# EAGLE design CS42436 Eval (EAGLE 6.3)
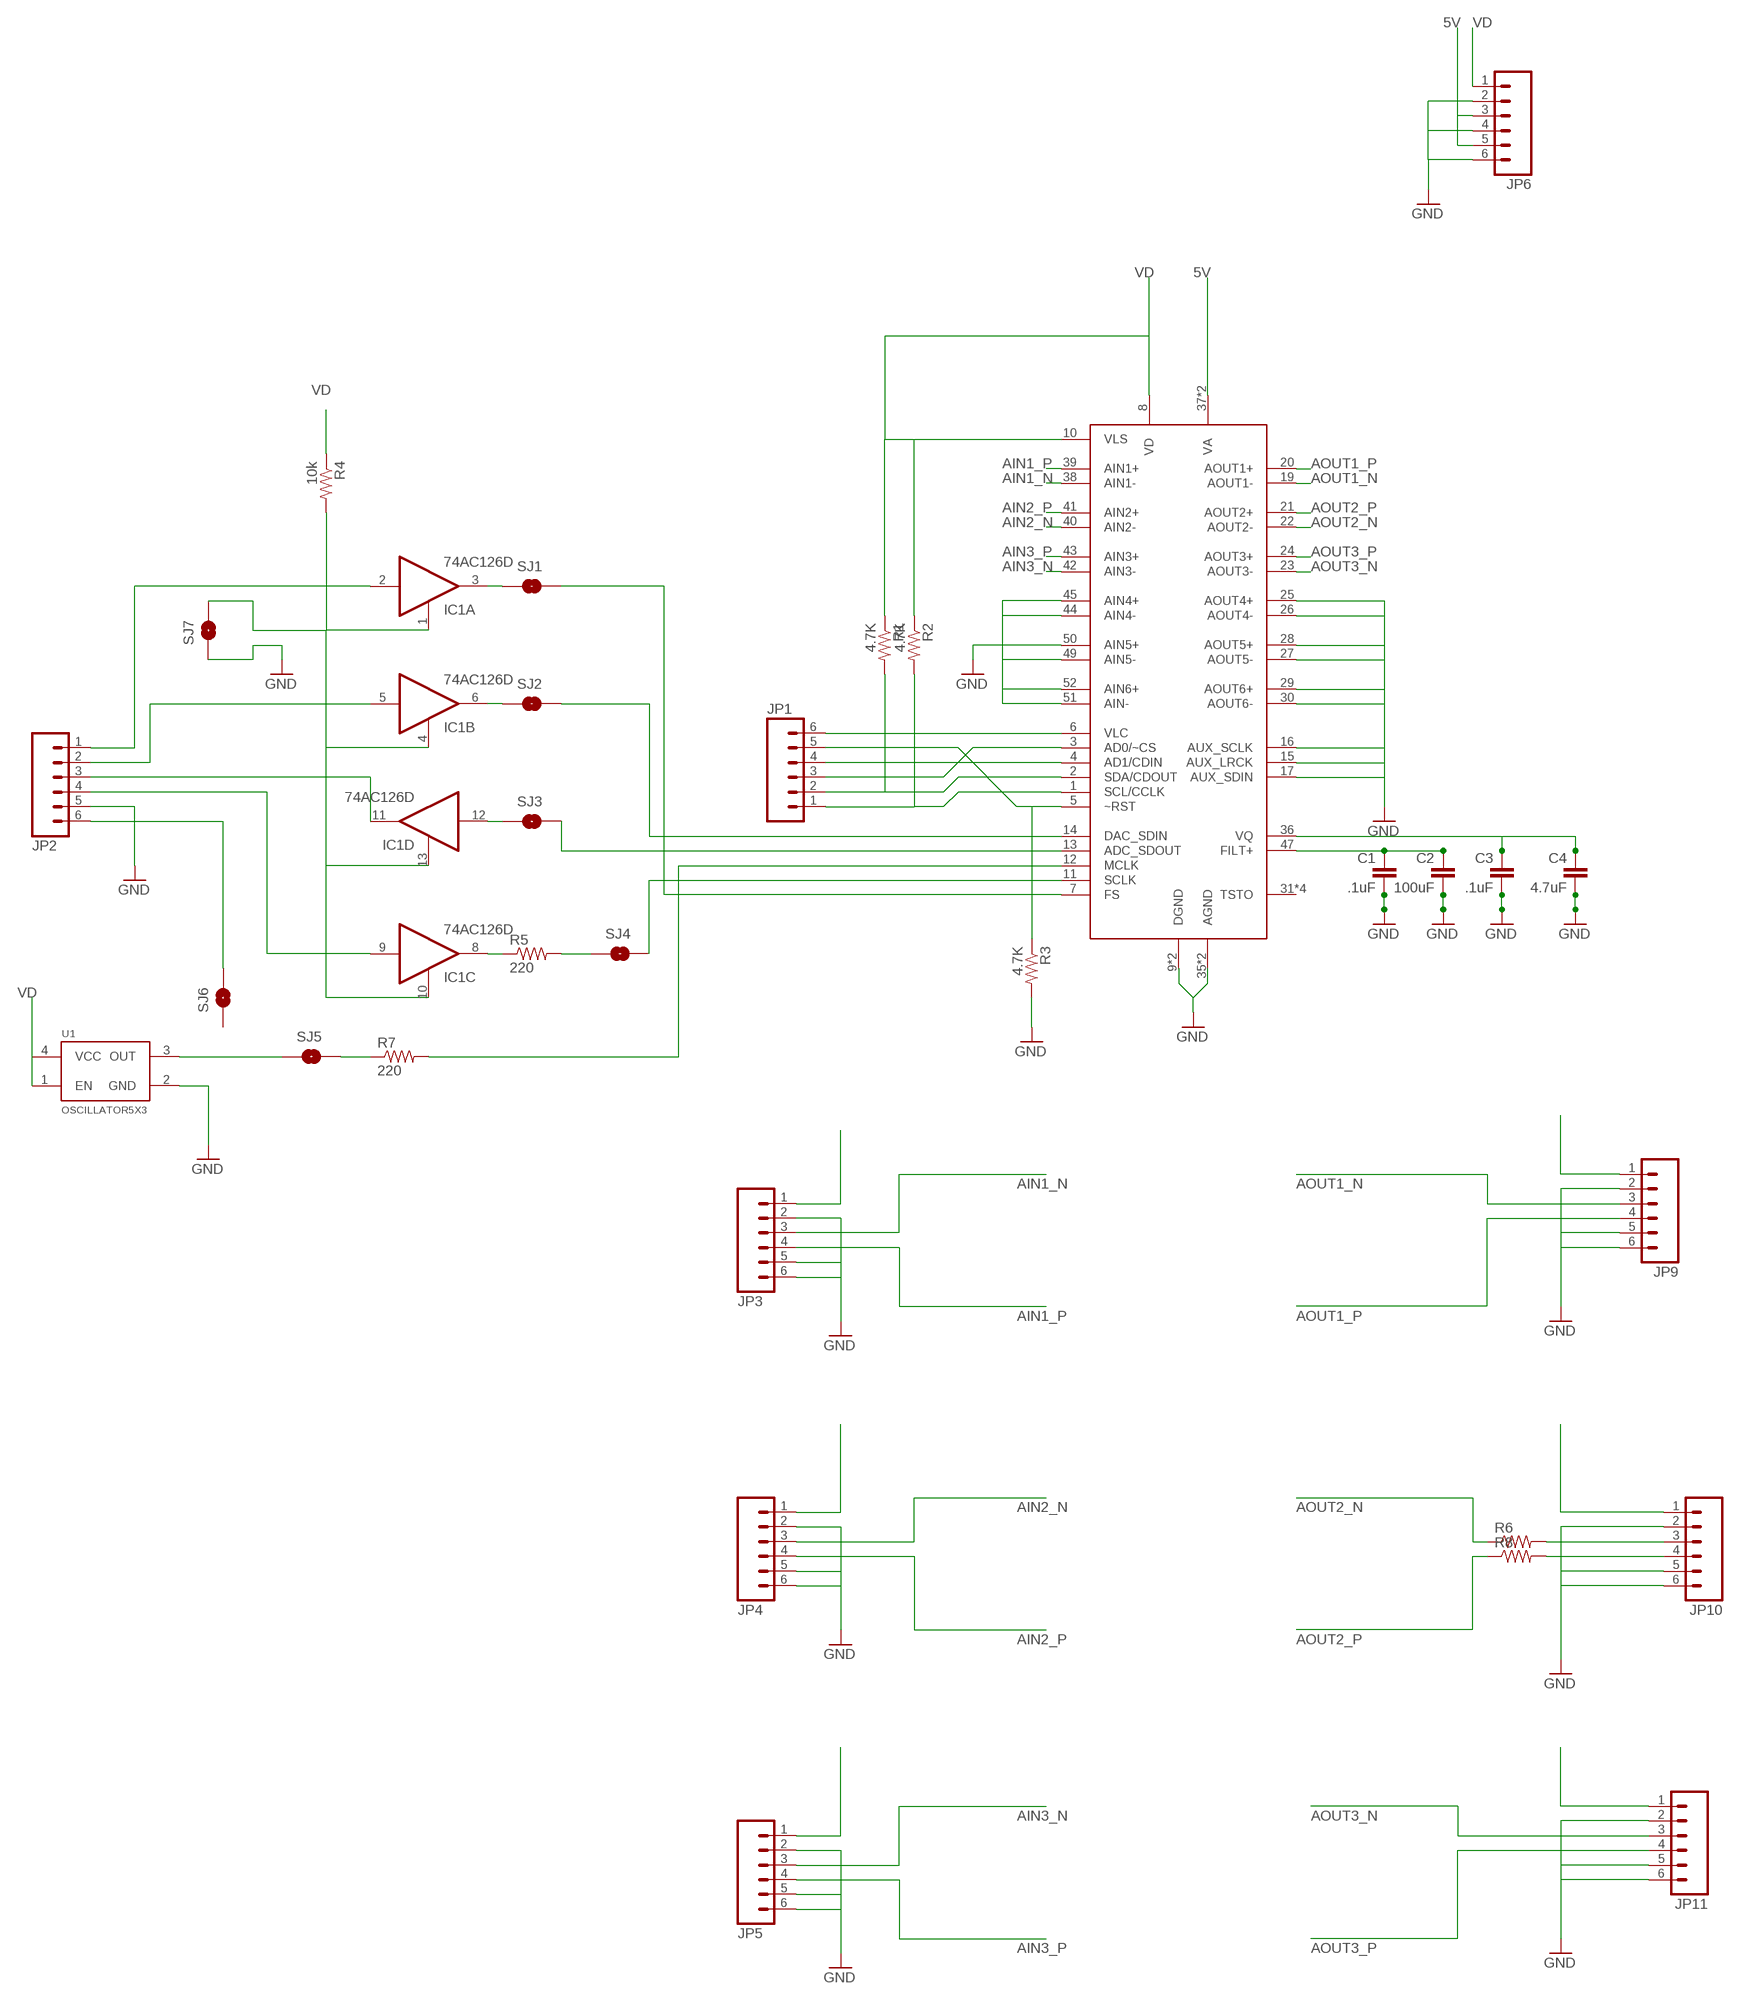
[diagram p0: schematic, sheet 1]

## Parts
C1  .1uF  CAP0603-CAP  [0603-CAP]
C2  100uF  CAP0603-CAP  [0603-CAP]
C3  .1uF  CAP0603-CAP  [0603-CAP]
C4  4.7uF  CAP0603-CAP  [0603-CAP]
IC1  74AC126D  [SO14]
JP1  M06SMD  [1X06-SMD]
JP2  M06SMD  [1X06-SMD]
JP3  M06SMD  [1X06-SMD]
JP4  M06SMD  [1X06-SMD]
JP5  M06SMD  [1X06-SMD]
JP6  M06SMD-STRAIGHT-ALT  [1X06_SMD_STRAIGHT_ALT]
JP9  M06SMD  [1X06-SMD]
JP10  M06SMD  [1X06-SMD]
JP11  M06SMD  [1X06-SMD]
R1  4.7K  R-US_R0402  [R0402]
R2  4.7K  R-US_R0402  [R0402]
R3  4.7K  R-US_R0402  [R0402]
R4  10k  R-US_R0402  [R0402]
R5  220  R-US_R0402  [R0402]
R6  RESISTOR1206  [1206]
R7  220  R-US_R0402  [R0402]
R8  RESISTOR1206  [1206]
SJ1  SOLDERJUMPERTRACE  [SJ_2S-TRACE]
SJ2  SOLDERJUMPERTRACE  [SJ_2S-TRACE]
SJ3  SOLDERJUMPERTRACE  [SJ_2S-TRACE]
SJ4  SOLDERJUMPERTRACE  [SJ_2S-TRACE]
SJ5  SOLDERJUMPERTRACE  [SJ_2S-TRACE]
SJ6  SOLDERJUMPERTRACE  [SJ_2S-TRACE]
SJ7  SOLDERJUMPERTRACE  [SJ_2S-TRACE]
U1  OSCILLATOR5X3  [CRYSTAL-SMD-5X3]
U$1  CS42436  [QFP-52]

## Nets
5V: JP6.3 JP6.5 U$1.37(VA) U$1.46(VA)
AIN1_N: JP3.3 U$1.38(AIN1-)
AIN1_P: JP3.4 U$1.39(AIN1+)
AIN2_N: JP4.3 U$1.40(AIN2-)
AIN2_P: JP4.4 U$1.41(AIN2+)
AIN3_N: JP5.3 U$1.42(AIN3-)
AIN3_P: JP5.4 U$1.43(AIN3+)
AOUT1_N: JP9.3 U$1.19(AOUT1-)
AOUT1_P: JP9.4 U$1.20(AOUT1+)
AOUT2_N: R6.1 U$1.22(AOUT2-)
AOUT2_NR: JP10.3 R6.2
AOUT2_P: R8.1 U$1.21(AOUT2+)
AOUT3_N: JP11.3 U$1.23(AOUT3-)
AOUT3_P: JP11.4 U$1.24(AOUT3+)
AOUT_2PN: JP10.4 R8.2
GND: C1.2 C2.2 C3.2 C4.2 JP2.5 JP3.2 JP3.5 JP3.6 JP4.2 JP4.5 JP4.6 JP5.2 JP5.5 JP5.6 JP6.2 JP6.4 JP6.6 JP9.2 JP9.5 JP9.6 JP10.2 JP10.5 JP10.6 JP11.2 JP11.5 JP11.6 R3.2 SJ7.1 U1.2(GND) U$1.9(DGND) U$1.15(AUX_LRCK) U$1.16(AUX_SCLK) U$1.17(AUX_SDIN) U$1.18(DGND) U$1.25(AOUT4+) U$1.26(AOUT4-) U$1.27(AOUT5-) U$1.28(AOUT5+) U$1.29(AOUT6+) U$1.30(AOUT6-) U$1.35(AGND) U$1.44(AIN4-) U$1.45(AIN4+) U$1.48(AGND) U$1.49(AIN5-) U$1.50(AIN5+) U$1.51(AIN-) U$1.52(AIN6+)
N$1: C1.1 C2.1 U$1.47(FILT+)
N$2: C3.1 C4.1 U$1.36(VQ)
N$3: SJ1.2 U$1.7(FS)
N$4: IC1.6(B:O) SJ2.1
N$5: IC1.2(A:I) JP2.1
N$6: IC1.1(A:OE) IC1.4(B:OE) IC1.10(C:OE) IC1.13(D:OE) R4.2 SJ7.2
N$7: R7.1 SJ5.2
N$8: IC1.11(D:O) JP2.3
N$9: IC1.5(B:I) JP2.2
N$10: IC1.12(D:I) SJ3.1
N$11: IC1.3(A:O) SJ1.1
N$12: SJ2.2 U$1.14(DAC_SDIN)
N$14: JP3.1
N$15: SJ3.2 U$1.13(ADC_SDOUT)
N$16: JP1.1 R2.2 U$1.1(SCL/CCLK)
N$17: JP4.1
N$18: JP1.2 R1.2 U$1.2(SDA/CDOUT)
N$19: JP1.3 U$1.3(AD0/~CS)
N$21: JP1.4 U$1.4(AD1/CDIN)
N$22: JP1.5 R3.1 U$1.5(~RST)
N$23: JP1.6 U$1.6(VLC)
N$24: IC1.8(C:O) R5.1
N$25: R5.2 SJ4.1
N$26: SJ4.2 U$1.11(SCLK)
N$29: R7.2 U$1.12(MCLK)
N$30: IC1.9(C:I) JP2.4
N$31: SJ5.1 U1.3(OUT)
N$32: JP2.6 SJ6.2
N$33: JP5.1
N$35: JP9.1
N$37: JP10.1
N$38: JP11.1
VD: JP6.1 R1.1 R2.1 R4.1 U1.1(EN) U1.4(VCC) U$1.8(VD) U$1.10(VLS)
Unconnected: SJ6.1 U$1.31(TSTO) U$1.32(TSTO) U$1.33(TSTO) U$1.34(TSTO)

## Power pins joined to a net without a drawn wire
GND: IC1.7(P:GND)
VCC: IC1.14(P:VCC)

## Library data of the parts
C1-C4 = 1x05smd:CAP: Capacitor Standard 0603 ceramic capacitor, and 0.1" leaded capacitor.
IC1 = 74xx-eu:74*126: Quad bus BUFFER, 3-state
JP1-JP6 JP9-JP11 = SparkFun-Connectors:M06: Header 6 Standard 6-pin 0.1" header. Use with straight break away headers (SKU : PRT-00116), right angle break away headers (PRT-00553), swiss pins (PRT-00743), machine pins (PRT-00117), and female headers (PRT-00115). Molex polarized connector foot print use with SKU : PRT-08094 with associated crimp pins and housings. NOTES ON THE VARIANTS LOCK and LOCK_LONGPADS... This footprint was designed to help hold the alignment of a through-hole component (i.e. 6-pin header) while soldering it into place. You may notice that each hole has been shifted either up or down by 0.005 of an inch from it's more standard position (which is a perfectly straight line). This slight alteration caused the pins (the squares in the middle) to touch the edges of the holes. Because they are alternating, it causes a "brace" to hold the component in place. 0.005 has proven to be the perfect amount of "off-center" position when using our standard breakaway headers. Although looks a little odd when you look at the bare footprint, once you have a header in there, the alteration is very hard to notice. Also,if you push a header all the way into place, it is covered up entirely on the bottom side. This idea of altering the position of holes to aid alignment will be further integrated into the Sparkfun Library for other footprints. It can help hold any component with 3 or more connection pins.
R1-R5 R7 = adafruit:R-US_: RESISTOR, American symbol
R6 R8 = SparkFun-Passives:RESISTOR: Resistor Basic schematic elements and footprints for 0603, 1206, and PTH resistors.
SJ1-SJ7 = 1x05smd:SOLDERJUMPER: Solder Jumper Standard SMD solder jumper. Used to automate production. Two varients : Normally Open and Normally Closed are the same, but have different paste layers. NC will have a large amount of paste and should jumper during reflow.
U1 = SparkFun-FreqCtrl:OSCILLATOR: Generic 5x3 and 7x5 oscillators
U$1 = Strutz Electronic Industries:CS42436

## Board
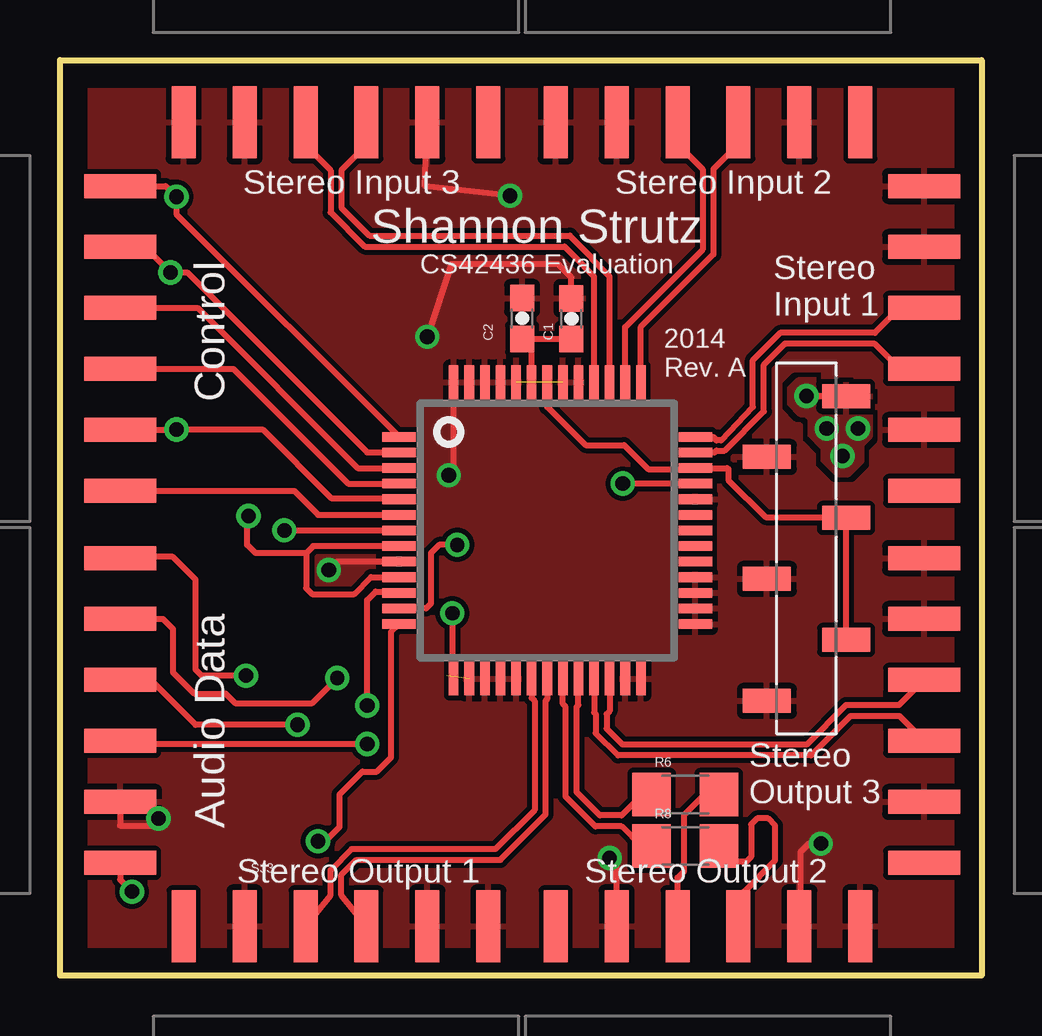
[diagram p1: board, top side]
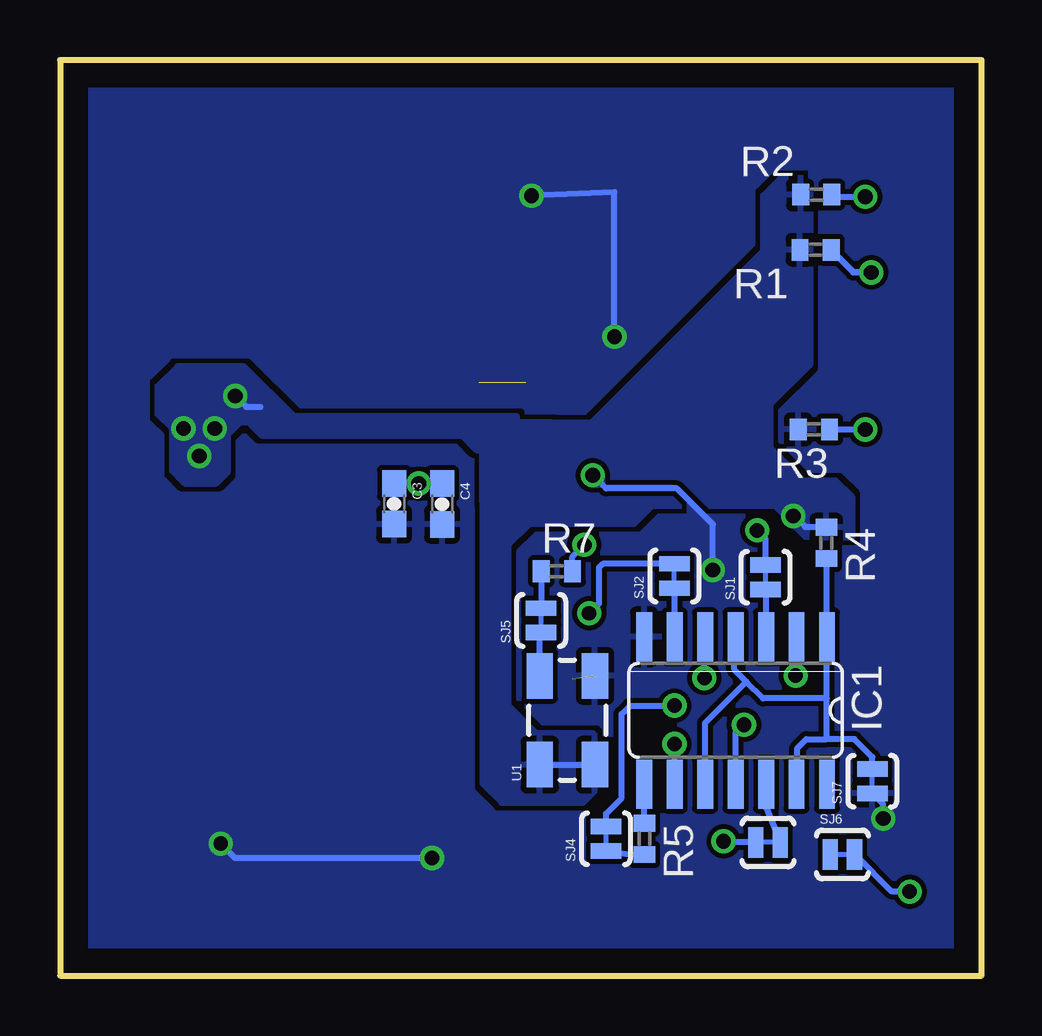
[diagram p2: board, bottom side, seen from below]

Size 38.4 x 38.15 mm. Coordinates in mm from the lower left corner, seen from the top.
Outline: 0,38.15 38.4,38.15 38.4,0 0,0 0,38.15
Copper layers (1*16): Top 0.035mm / dielectric 1.5mm / Bottom 0.035mm
Design rules "default": minimum track width 10mil, minimum drill 24mil, track to track 8mil, track to pad 8mil, pad to pad 8mil, via to via 8mil, smd to smd 8mil, copper to edge 40mil, drill to drill 8mil, minimum pad ring 10mil, minimum via ring 8mil, stop-mask expansion 4mil, vias tented up to drill 0mil, thermal gap 10mil

### Footprints (pad centres in the part's own frame; a part is rotated, then mirrored left to right if it is on the bottom)
0603-CAP = smd 1.1 x 1: 1 -0.85,0; 2 0.85,0
SO14 = smd 0.66 x 2.032: 1 -3.81,-3.073; 2 -2.54,-3.073; 3 -1.27,-3.073; 4 0,-3.073; 5 1.27,-3.073; 6 2.54,-3.073; 7 3.81,-3.073; 8 3.81,3.073; 9 2.54,3.073; 10 1.27,3.073; 11 0,3.073; 12 -1.27,3.073; 13 -2.54,3.073; 14 -3.81,3.073
1X06-SMD = smd 1 x 3: 1 -6.35,5; 2 -3.81,5; 3 -1.27,5; 4 1.27,5; 5 3.81,5; 6 6.35,5
1X06_SMD_STRAIGHT_ALT = smd 1 x 2: 1 0,-1.65; 2 -2.54,1.65; 3 -5.08,-1.65; 4 -7.62,1.65; 5 -10.16,-1.65; 6 -12.7,1.65
R0402 = smd 0.7 x 0.9: 1 -0.65,0; 2 0.65,0
1206 = smd 1.6 x 1.8: 1 -1.4,0; 2 1.4,0
SJ_2S-TRACE = smd 0.635 x 1.27: 1 -0.508,0; 2 0.508,0
CRYSTAL-SMD-5X3 = smd 1.9 x 1.1: 1 -1.85,-1.15; 2 1.85,-1.15; 3 1.85,1.15; 4 -1.85,1.15
QFP-52 = smd 1.4 x 0.4: 1 -6.175,3.9; 2 -6.175,3.25; 3 -6.175,2.6; 4 -6.175,1.95; 5 -6.175,1.3; 6 -6.175,0.65; 7 -6.175,0; 8 -6.175,-0.65; 9 -6.175,-1.3; 10 -6.175,-1.95; 11 -6.175,-2.6; 12 -6.175,-3.25; 13 -6.175,-3.9; 27 6.175,-3.9; 28 6.175,-3.25; 29 6.175,-2.6; 30 6.175,-1.95; 31 6.175,-1.3; 32 6.175,-0.65; 33 6.175,0; 34 6.175,0.65; 35 6.175,1.3; 36 6.175,1.95; 37 6.175,2.6; 38 6.175,3.25; 39 6.175,3.9 | smd 0.4 x 1.4: 14 -3.9,-6.175; 15 -3.25,-6.175; 16 -2.6,-6.175; 17 -1.95,-6.175; 18 -1.3,-6.175; 19 -0.65,-6.175; 20 0,-6.175; 21 0.65,-6.175; 22 1.3,-6.175; 23 1.95,-6.175; 24 2.6,-6.175; 25 3.25,-6.175; 26 3.9,-6.175; 40 3.9,6.175; 41 3.25,6.175; 42 2.6,6.175; 43 1.95,6.175; 44 1.3,6.175; 45 0.65,6.175; 46 0,6.175; 47 -0.65,6.175; 48 -1.3,6.175; 49 -1.95,6.175; 50 -2.6,6.175; 51 -3.25,6.175; 52 -3.9,6.175

### Placement (x,y rotation side)
C1  21.31,27.37 90 top
C2  19.26,27.38 90 top
C3  24.48,19.66 270 bottom
C4  22.48,19.65 270 bottom
IC1  10.25,11.05 180 bottom
JP1  -2.5,26.55 270 top
JP2  -2.5,11.05 270 top
JP3  41,26.55 90 top
JP4  27,40.55 180 top
JP5  11.5,40.55 180 top
JP6  31.1,24.15 90 top
JP9  11.5,-2.95 0 top
JP10  27,-2.95 0 top
JP11  41,11.05 90 top
R1  6.92,30.24 0 bottom
R2  6.89,32.54 0 bottom
R3  6.99,22.76 180 bottom
R4  6.47,18.03 270 bottom
R5  14.05,5.7 270 bottom
R6  26.05,7.55 0 top
R7  17.7,16.85 0 bottom
R8  26.05,5.4 0 top
SJ1  9,16.6 90 bottom
SJ2  12.8,16.65 90 bottom
SJ3  8.9,5.55 180 bottom
SJ4  15.65,5.7 90 bottom
SJ5  18.35,14.8 90 bottom
SJ6  5.8,5.05 0 bottom
SJ7  4.55,8.1 90 bottom
U1  17.26,10.64 90 bottom
U$1  20.3,18.55 0 top

### Tracks (layer width: path | path; a pad name or v marks a point on that pad's centre or on a via)
5V
  Top 0.254: U$1.46 20.3,23.7 21.9,22.1 23.5,22.1 24.5,21.1 26.43,21.1 U$1.37 27.8,21.15 27.85,21.1 27.85,20.65 29.4,19.1 32.25,19.1 | 32.25,19.1 32.72,19.1 JP6.3 | JP6.5 32.75,18.6 32.25,19.1
AIN1_N
  Top 0.254: JP3.3 34.99,25.28 33.95,26.32 30.23,26.32 30.21,26.34 29.33,25.46 29.33,23.5 27.7,21.87 27.35,21.87 27.28,21.8 U$1.38
AIN1_P
  Top 0.254: JP3.4 34.99,27.82 33.95,26.78 30,26.78 28.87,25.64 28.87,23.7 27.55,22.3 27.35,22.3 27.23,22.45 U$1.39
AIN2_N
  Top 0.254: JP4.3 28.27,34.64 27.23,33.6 27.23,30.05 24.2,27.03 U$1.40
AIN2_P
  Top 0.254: JP4.4 25.73,34.64 26.77,33.6 26.77,30.25 23.55,27.02 U$1.41
AIN3_N
  Top 0.254: JP5.3 12.77,34.59 11.73,33.55 11.73,32 12.89,30.83 21.25,30.83 22.16,29.91 22.16,29.86 22.9,29.12 U$1.42
AIN3_P
  Top 0.254: JP5.4 10.23,34.59 11.27,33.55 11.27,31.8 12.71,30.37 21.02,30.37 21.05,30.35 21.84,29.56 21.84,29.54 22.25,29.13 U$1.43
AOUT1_N
  Top 0.254: JP9.3 11.27,3.35 11.27,4.39 12.15,5.28 18.16,5.28 19.77,6.89 19.77,11.45 19.65,11.57 U$1.19
AOUT1_P
  Top 0.254: JP9.4 11.73,3.35 11.73,4.21 12.35,4.82 18.34,4.82 20.23,6.71 20.23,11.45 20.3,11.52 U$1.20
AOUT2_N
  Top 0.254: R6.1 24.27,7.55 23.4,6.68 22.5,6.68 21.53,7.64 21.53,11.2 21.6,11.27 U$1.22
AOUT2_NR
  Top 0.254: JP10.3 25.73,4.08 26,4.35 26,6.7 26.9,7.6 27.4,7.6 R6.2
AOUT2_P
  Top 0.254: R8.1 24.22,5.4 23.4,6.22 22.3,6.22 21.07,7.46 21.07,11.2 20.95,11.32 U$1.21
AOUT3_N
  Top 0.254: JP11.3 34.96,10.82 32.95,10.82 31.3,9.17 23.25,9.17 22.32,10.11 22.32,10.9 22.25,10.97 U$1.23
AOUT3_P
  Top 0.254: JP11.4 34.96,11.28 32.76,11.28 31.11,9.63 23.45,9.63 22.78,10.29 22.78,10.9 22.9,11.02 U$1.24
AOUT_2PN
  Top 0.254: JP10.4 28.5,2.28 28.5,3.5 29.8,4.8 29.8,6.25 29.5,6.55 29.05,6.55 28.8,6.3 28.8,4.95 28.6,4.75 28.1,4.75 R8.2
GND  (via drill 0.6 pad 0.25, 0.61 pad 0.25)  (2 unrouted)
  Top 0.254: JP10.2 23.19,4.61 v22.9,4.9 | v31.7,5.5 31.2,5.5 30.85,5.15 30.85,2.09 JP10.5 | JP2.5 2.5,6.25 3.8,6.25 v4.1,6.55 | C1.2 21.31,29.09 20.75,29.65 16.3,29.65 v15.3,26.62 | v18.76,32.5 15.2,32.9 JP5.2 | U$1.9 11.55,17.25 v11.2,16.9 | v16.2,20.85 16.4,21.05 U$1.52
  Bottom 0.254: v22.9,4.9 31.1,4.9 v31.7,5.5 | v4.1,6.55 4.1,7.14 SJ7.1 | v15.3,26.62 15.3,32.65 v18.76,32.5 | v11.2,16.9 11.2,18.8 12.7,20.3 15.65,20.3 v16.2,20.85
  pour Top (rank 6): 0,38.15 38.4,38.15 38.4,0 0,0
  pour Bottom (rank 6): 0,0 38.4,0 38.4,38.15 0,38.15
N$1
  Top 0.254: U$1.47 19.65,26.14 C2.1 C1.1
N$2  (via drill 0.61 pad 0.25)
  Top 0.254: U$1.36 v23.45,20.5
  Bottom 0.254: C4.1 23.3,20.57 v23.45,20.5 24.48,20.62 C3.1
N$3  (via drill 0.6 pad 0.25)
  Top 0.254: v9.35,18.55 U$1.7
  Bottom 0.254: SJ1.2 9,18.2 v9.35,18.55
N$4
  Bottom 0.254: SJ2.1 12.8,14.13 IC1.6
N$5  (via drill 0.6 pad 0.25)
  Top 0.254: v7.75,12.5 5.9,12.5 5.65,12.75 5.65,16.5 4.7,17.45 2.05,17.45 1.95,17.35 2.45,17.35 JP2.1
  Bottom 0.254: IC1.2 7.71,12.54 v7.75,12.5
N$6
  Bottom 0.254: SJ7.2 4.55,9.1 5.3,9.85 6.45,9.85 | IC1.13 7.7,9.45 7.3,9.85 6.45,9.85 | 6.45,9.85 6.45,11.55 | 6.45,11.55 IC1.1 6.47,14.15 | R4.2 6.47,14.15 | 6.47,14.15 6.47,11.57 6.45,11.55 | 6.45,11.55 9.1,11.55 9.8,12.25 | 9.8,12.25 10.3,12.75 10.3,14.07 IC1.4 | IC1.10 11.52,10.53 9.8,12.25
N$7
  Bottom 0.254: R7.1 SJ5.2
N$8  (via drill 0.61 pad 0.25)
  Top 0.254: v9.9,10.45 5.65,10.45 3.94,12.16 2.41,12.16 JP2.3
  Bottom 0.254: IC1.11 10.25,10.1 v9.9,10.45
N$9  (via drill 0.6 pad 0.25)
  Top 0.254: JP2.2 4.29,14.86 4.7,14.45 4.7,12.65 5.6,11.75 6.9,11.75 7.3,11.35 10.5,11.35 v11.55,12.4
  Bottom 0.254: v11.55,12.4 11.55,14.09 IC1.5
N$10
  Bottom 0.254: IC1.12 8.98,6.99 SJ3.1
N$11
  Bottom 0.254: SJ1.1 9,14.14 IC1.3
N$12  (via drill 0.6 pad 0.25)
  Top 0.254: v16.35,15.1 16.35,12.43 U$1.14
  Bottom 0.254: SJ2.2 15.79,17.16 15.95,17 15.95,15.5 v16.35,15.1
N$15  (via drill 0.61 pad 0.25)
  Top 0.254: v10.75,5.6 11.05,5.6 11.65,6.2 11.65,7.55 12.6,8.5 13.2,8.5 13.8,9.1 13.8,14.33 U$1.13
  Bottom 0.254: SJ3.2 10.7,5.55 v10.75,5.6
N$16  (via drill 0.61 pad 0.25)
  Top 0.254: JP1.1 4.4,32.9 v4.85,32.45 4.85,31.73 U$1.1
  Bottom 0.254: 6.1,32.45 6.15,32.45 R2.2 6.19,32.54 6.1,32.45 | 6.1,32.45 v4.85,32.45
N$18  (via drill 0.61 pad 0.25)
  Top 0.254: JP1.2 3.54,30.36 v4.6,29.3 5.3,29.3 12.8,21.8 U$1.2
  Bottom 0.254: v4.6,29.3 5.33,29.3 R1.2 6.27,30.22 5.35,29.3 v4.6,29.3
N$19
  Top 0.254: JP1.3 5.73,27.82 12.4,21.15 U$1.3
N$21
  Top 0.254: JP1.4 7.22,25.28 12,20.5 U$1.4
N$22  (via drill 0.61 pad 0.25)
  Top 0.254: JP1.5 v4.86,22.74 | U$1.5 14.07,19.9 11.3,19.9 8.46,22.74 v4.86,22.74 | v4.86,22.74 v4.85,22.75
  Bottom 0.254: v4.85,22.75 R3.1
N$23
  Top 0.254: JP1.6 9.75,20.2 10.75,19.2 U$1.6
N$24
  Bottom 0.254: R5.1 14.05,7.97 IC1.8
N$25
  Bottom 0.254: SJ4.1 14.69,5.06 R5.2
N$26  (via drill 0.61 pad 0.25)
  Top 0.254: v12.8,11.25 12.8,15.65 13.15,16 14.07,16 U$1.11
  Bottom 0.254: SJ4.2 15.65,6.75 15,7.4 15,10.9 14.65,11.25 v12.8,11.25
N$29  (via drill 0.6 pad 0.25)
  Top 0.254: v16.55,17.95 15.8,17.95 15.45,17.6 15.45,15.5 15.25,15.3 U$1.12
  Bottom 0.254: R7.2 17.05,17.45 v16.55,17.95
N$30  (via drill 0.61 pad 0.25)
  Top 0.254: v12.8,9.65 2.63,9.65 JP2.4
  Bottom 0.254: IC1.9 v12.79,9.64 v12.8,9.65
N$31
  Bottom 0.254: U1.3 18.41,14.23 SJ5.1
N$32  (via drill 0.6 pad 0.25)
  Top 0.254: JP2.6 2.5,4 v3,3.5
  Bottom 0.254: v3,3.5 3.74,3.5 SJ6.2
VD  (via drill 0.61 pad 0.25)
  Top 0.254: 10.25,17.6 8.15,17.6 7.8,17.95 7.8,19.1 v7.85,19.15 | U$1.8 10.55,17.9 10.25,17.6 | 14.07,16.65 U$1.10 12.95,16.6 12.25,15.9 10.5,15.9 10.25,16.15 10.25,17.6 | JP6.1 v31.1,24.15
  Bottom 0.254: U1.4 U1.1 | v7.85,19.15 7.8,19.15 7.35,18.7 6.49,18.7 R4.1 | v31.1,24.15 30.65,23.7 30.05,23.7
  other vias: 31.95,22.8 33.25,22.8 32.6,21.65
  pour Bottom (rank 4): 5.4,19.95 5.4,18.25 7.3,18.25 8.6,19.55 13.75,19.55 14.5,18.8 19.5,18.8 20.8,19.7 20.8,21.9 19.55,23.1 16.25,23.05 9.1,30.2 9.1,32.5 8.35,33.25 7.2,33.25 7.15,33.2 7.15,25.45 8.8,23.8 8.8,22 7.45,20.65 6.1,20.65
  pour Bottom (rank 4): 18.85,19.7 20.75,19.7 20.8,19.65 20.8,8 20,7.2 16.6,7.2 15.8,8 15.8,9.7 16.2,10.1 18.55,10.1 19.7,11.25 19.7,17.95 18.9,18.75 18.9,19.65
  pour Bottom (rank 4): 19.35,23.3 28.65,23.3 30.75,25.4 33.5,25.4 34.35,24.55 34.35,23.4 33.75,22.8 33.75,21.05 33.2,20.5 31.9,20.5 31.4,21 31.4,22.55 30.9,23.05 30.55,23.05 30,22.5 21.65,22.5 21.05,21.9 19.55,21.9 19.35,22.1
  pour Top (rank 4): 33.65,24.6 31.75,24.6 31.55,24.8 30.75,24.8 30.4,24.45 30.4,23.85 30.85,23.4 31.05,23.4 31.25,23.2 31.25,22.55 31.8,22 31.8,21.5 32.4,20.9 32.85,20.9 33.4,21.45 33.4,22.15 33.75,22.5 33.75,24.45 33.65,24.55

### Text on the board
_tsilk: Stereo Input 3 | Stereo Input 2 | Shannon Strutz | CS42436 Evaluation | Stereo / Input 1 | 2014 / Rev. A | Control | Stereo / Output 3 | Audio Data | Stereo Output 1 | Stereo Output 2